# Altium project Main_Board.PrjPcb
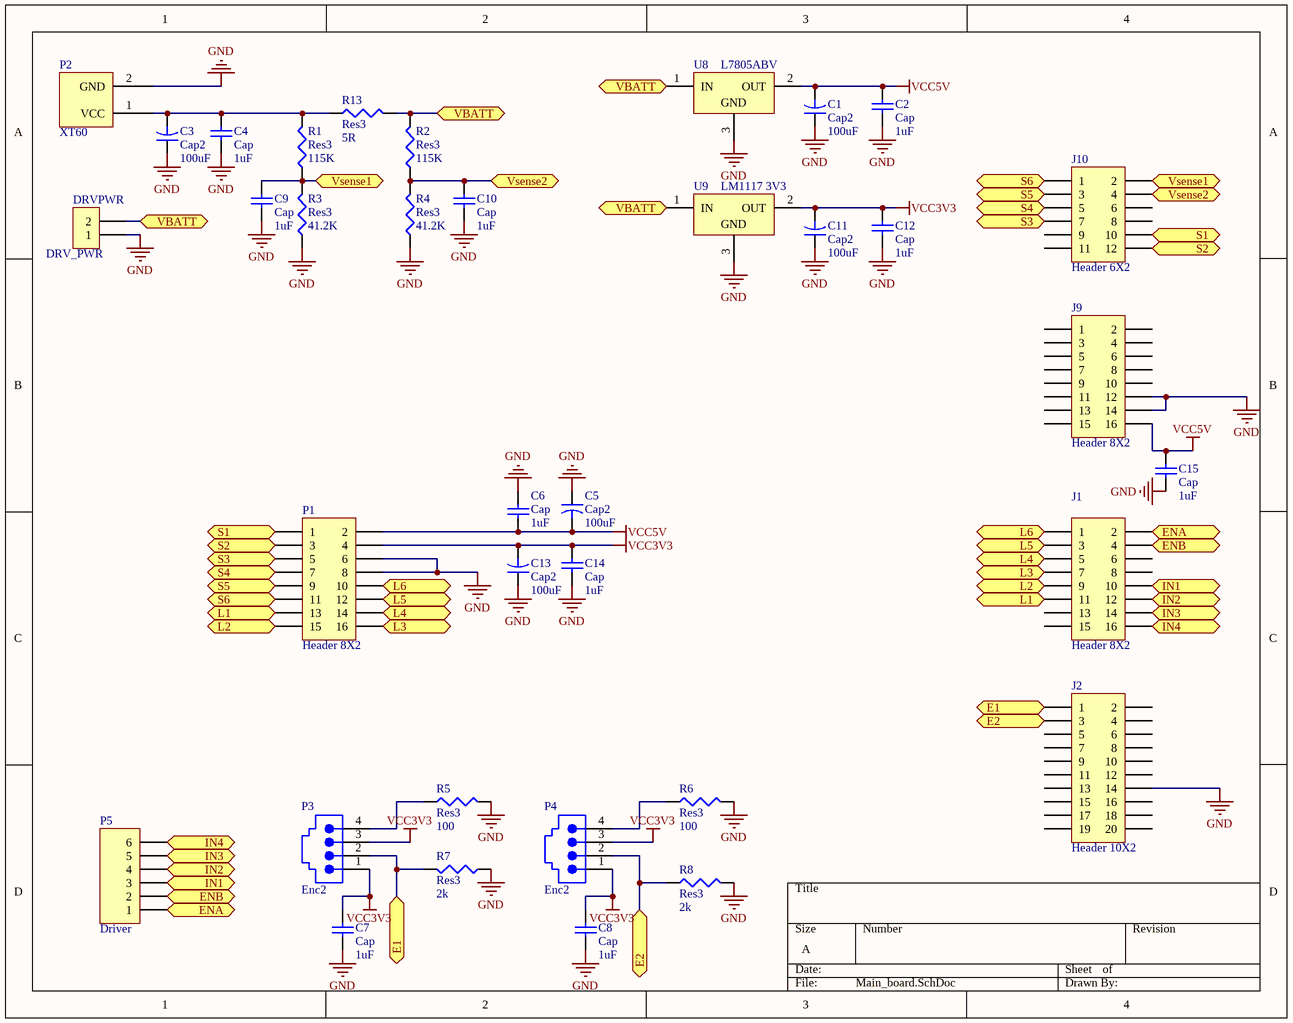
[diagram p0: Main_board.SchDoc]
1 sheet, 36 parts. Net scope: flat (ports and power ports of the same name join across sheets).
Board file: Main_board.PcbDoc

## Sheet Main_board.SchDoc
size A

### Parts
C1  Cap2  value 100uF  [CAPR5-4X5]
C2  Cap  value 1uF  [RAD-0.1]
C3  Cap2  value 100uF  [CAPR5-4X5]
C4  Cap  value 1uF  [RAD-0.1]
C5  Cap2  value 100uF  [CAPR5-4X5]
C6  Cap  value 1uF  [RAD-0.1]
C7  Cap  value 1uF  [RAD-0.1]
C8  Cap  value 1uF  [RAD-0.1]
C9  Cap  value 1uF  [RAD-0.1]
C10  Cap  value 1uF  [RAD-0.1]
C11  Cap2  value 100uF  [CAPR5-4X5]
C12  Cap  value 1uF  [RAD-0.1]
C13  Cap2  value 100uF  [CAPR5-4X5]
C14  Cap  value 1uF  [RAD-0.1]
C15  Cap  value 1uF  [RAD-0.1]
DRVPWR  DRV_PWR  [691311700002]
J1  Header 8X2  [HDR2X8]
J2  Header 10X2  [HDR2X10]
J9  Header 8X2  [HDR2X8]
J10  Header 6X2  [HDR2X6]
P1  Header 8X2  [HDR2X8]
P2  XT60  [PCBComponent_1]
P3  Enc2  [43249-6104]
P4  Enc2  [43249-6104]
P5  Driver  [HDR1X6]
R1  Res3  value 115K  [AXIAL-0.3]
R2  Res3  value 115K  [AXIAL-0.3]
R3  Res3  value 41.2K  [AXIAL-0.3]
R4  Res3  value 41.2K  [AXIAL-0.3]
R5  Res3  value 100  [AXIAL-0.3]
R6  Res3  value 100  [AXIAL-0.3]
R7  Res3  value 2k  [AXIAL-0.3]
R8  Res3  value 2k  [AXIAL-0.3]
R13  Res3  value 5R  [AXIAL-0.5]
U8  L7805ABV  [TO220ABN]
U9  LM1117 3V3  [TO220VW]

### Ports
E1, E2, ENA, ENB, IN1, IN2, IN3, IN4, L1, L2, L3, L4, L5, L6, S1, S2, S3, S4, S5, S6, VBATT, Vsense1, Vsense2

### Nets
GND: C1.1 C2.1 C3.1 C4.1 C5.1 C6.1 C7.1 C8.1 C9.1 C10.1 C11.1 C12.1 C13.1 C14.1 C15.1 DRVPWR.1 J2.14 J9.12 J9.14 P1.6 P1.8 P2.2(GND) R3.1 R4.1 R5.2 R6.2 R7.1 R8.2 U8.3(GND) U9.3(GND)
VCC3V3: C7.2 C8.2 C11.2 C12.2 C13.2 C14.2 P1.4 P3.1 P3.3 P4.1 P4.3 U9.2(OUT)
VCC5V: C1.2 C2.2 C5.2 C6.2 C15.2 J9.16 P1.2 U8.2(OUT)
NetC3_2: C3.2 C4.2 P2.1(VCC) R1.2 R13.1
NetC9_2: C9.2 J10.2 R1.1 R3.2 ; port Vsense1
NetC10_2: C10.2 J10.4 R2.1 R4.2 ; port Vsense2
NetDRVPWR_2: DRVPWR.2 R2.2 R13.2 U8.1(IN) U9.1(IN) ; port VBATT
NetJ1_1: J1.1 P1.10 ; port L6
NetJ1_2: J1.2 P5.1 ; port ENA
NetJ1_3: J1.3 P1.12 ; port L5
NetJ1_4: J1.4 P5.2 ; port ENB
NetJ1_5: J1.5 P1.14 ; port L4
NetJ1_7: J1.7 P1.16 ; port L3
NetJ1_9: J1.9 P1.15 ; port L2
NetJ1_10: J1.10 P5.3 ; port IN1
NetJ1_11: J1.11 P1.13 ; port L1
NetJ1_12: J1.12 P5.4 ; port IN2
NetJ1_14: J1.14 P5.5 ; port IN3
NetJ1_16: J1.16 P5.6 ; port IN4
NetJ2_1: J2.1 P3.2 R7.2 ; port E1
NetJ2_3: J2.3 P4.2 R8.1 ; port E2
NetJ10_1: J10.1 P1.11 ; port S6
NetJ10_3: J10.3 P1.9 ; port S5
NetJ10_5: J10.5 P1.7 ; port S4
NetJ10_7: J10.7 P1.5 ; port S3
NetJ10_10: J10.10 P1.1 ; port S1
NetJ10_12: J10.12 P1.3 ; port S2
NetP3_4: P3.4 R5.1
NetP4_4: P4.4 R6.1

Not connected (* = marked no-connect by the designer): J1 6 8 13 15; J2 2 4 5 6 7 8 9 10 11 12 13 15 16 17 18 19 20; J9 1 2 3 4 5 6 7 8 9 10 11 13 15; J10 6 8 9 11

### Library data of the parts
C1 C3 C5 C11 C13 = Cap2: Capacitor; Published: 23-Sep-2002; PackageReference: CAPR5-4X5; Publisher: Altium Limited; PackageDescription: Capacitor; 2 Leads
C2 C4 C6-C10 C12 C14 C15 = Cap: Capacitor; Published: 8-Jun-2000; LatestRevisionDate: 17-Jul-2002; LatestRevisionNote: Re-released for DXP Platform.; PackageReference: RAD-0.3; Publisher: Altium Limited; PackageDescription: Radial Cap, Thru-Hole; 2 Leads; 0.3 in Pin Spacing
DRVPWR = 691311700002: WR-TBL Terminal block - serie 3117 - 5.00mm; Manufacturer: Würth Elektronik eiSos GmbH; ComponentLink1 Description: Manufacturer; ComponentLink2 Description: Datasheet; NoPins: 02; Created Date: 6 January 2014; partNo: 691311700002; ComponentLink1URL: http://www.we-online.com; ComponentLink2URL: http://katalog.we-online.de/em/datasheet/6913117000xx.pdf; Created by: Karrer Zheng
J1 J9 P1 = Header 8X2: Header, 8-Pin, Dual row; LatestRevisionDate: 17-Jul-2002; LatestRevisionNote: Re-released for DXP Platform.; Publisher: Altium Limited
J2 = Header 10X2: Header, 10-Pin, Dual row; LatestRevisionDate: 17-Jul-2002; LatestRevisionNote: Re-released for DXP Platform.; Publisher: Altium Limited
J10 = Header 6X2: Header, 6-Pin, Dual row; LatestRevisionDate: 17-Jul-2002; LatestRevisionNote: Re-released for DXP Platform.; Publisher: Altium Limited
P2 = Component_1
P3 P4 = 43249-6104: Right Angle, Low Profile, Flangeless, Unshielded PCB Jack; Ports: 1; Positions/Loaded: Port1 - 6/4; PerformanceCategory: 3/4; PCB_Mounting: Thru-Hole; DrillSize: Nominal, Rounded to nearest 0.05mm; PCB_Layout: Complies with Manufacturer's Recommendation.; Publisher: Altium Limited; Published: 25-Jun-2002; DatasheetDocument: 18-Dec-2001; PackageDocument: 18-Dec-2001; PackageReference: 43249-6104; ComponentLink1Description: Manufacturer Link; ComponentLink1URL: http://www.molex.com/; ComponentLink2Description: Datasheet; ComponentLink2URL: http://www.molex.com/cmc_upload/common_files/1212003_43249catalogpage.pdf
P5 = Header 6: Header, 6-Pin; LatestRevisionDate: 17-Jul-2002; LatestRevisionNote: Re-released for DXP Platform.; Publisher: Altium Limited
R1-R8 R13 = Res3: Resistor; Published: 8-Jun-2000; LatestRevisionDate: 29-May-2009; LatestRevisionNote: IPC-7351 Footprint Added.; PackageReference: J1-0603; Publisher: Altium Limited; PackageDescription: Chip Resistor
U8 = L7805ABV: Precision 1A Regulator; Note: Tab is connected to pin 3 (GND).; Published: 24-Aug-2001; LatestRevisionDate: 17-Jul-2002; LatestRevisionNote: Re-released for DXP Platform.; DatasheetVersion: Nov-1999; PackageVersion: Jun-1998; PackageReference: TO220ABN; Publisher: Altium Limited; PackageDescription: TO, Thru-Hole, Vertical, Heatsink Mounted; 3 In-Line Leads; Pitch 2.54 mm; Pin sequence 1, 3, 2; ComponentLink1Description: Manufacturer Link; ComponentLink1URL: http://www.st.com/; ComponentLink2Description: Datasheet; ComponentLink2URL: http://www.st.com/stonline/products/literature/ds/2144/l7805ab.pdf
U9 = L78S05CV: 2A Positive Voltage Regulator; Note: Tab is connected to pin 3 (GND).; Published: 24-Aug-2001; LatestRevisionDate: 17-Jul-2002; LatestRevisionNote: Re-released for DXP Platform.; DatasheetVersion: Jan-1993; PackageVersion: Apr-1998; PackageReference: TO220VW; Publisher: Altium Limited; PackageDescription: TO, Thru-Hole, Vertical, Heatsink Mounted; 3 In-Line Leads; Pitch 2.54 mm; Pin sequence 1, 3, 2; ComponentLink1Description: Manufacturer Link; ComponentLink1URL: http://www.st.com/; ComponentLink2Description: Datasheet; ComponentLink2URL: http://www.st.com/stonline/products/literature/ds/2148/l78s10c.pdf